# EAGLE design ENCODER_BUFFER (EAGLE 9.6.2)
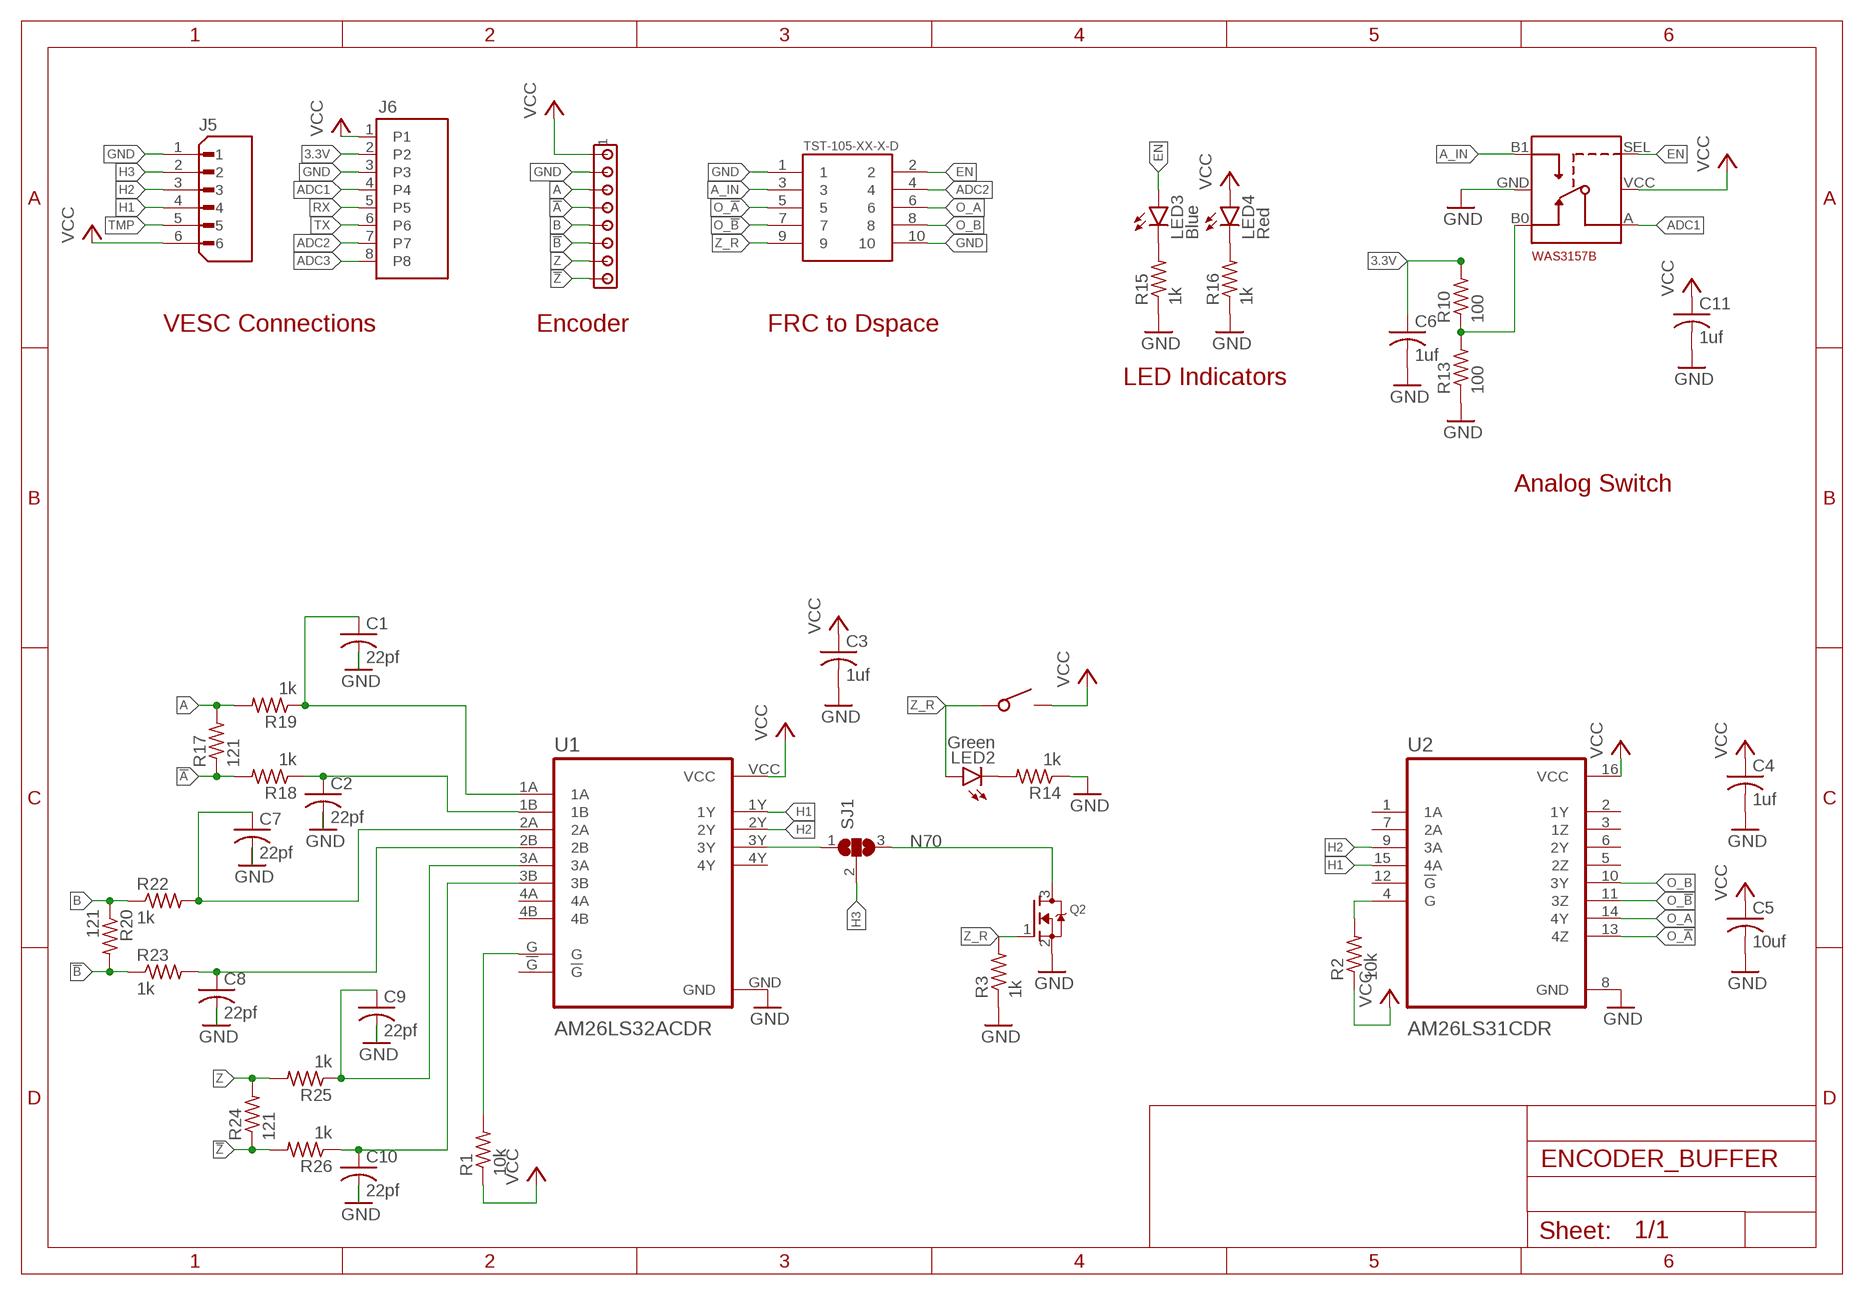
[diagram p0: schematic, sheet 1]

## Parts
C1  22pf  C-USC0402  [C0402]
C2  22pf  C-USC0402  [C0402]
C3  1uf  C-USC0402  [C0402]
C4  1uf  C-USC0402  [C0402]
C5  10uf  C-USC0402  [C0402]
C6  1uf  C-USC0402  [C0402]
C7  22pf  C-USC0402  [C0402]
C8  22pf  C-USC0402  [C0402]
C9  22pf  C-USC0402  [C0402]
C10  22pf  C-USC0402  [C0402]
C11  1uf  C-USC0402  [C0402]
J2  TST-105-XX-X-D  [TST-105-XX-X-D]
J3  MTA08-100  [10X08MTA]
J5  B6B-PH-K-S(LF)(SN)  [JST_B6B-PH-K-S(LF)(SN)]
J6  B8B-PH-K-S(LF)(SN)  [JST_B8B-PH-K-S(LF)(SN)]
LED2  Green  LEDCHIPLED_0603  [CHIPLED_0603]
LED3  Blue  LEDCHIPLED_0603  [CHIPLED_0603]
LED4  Red  LEDCHIPLED_0603  [CHIPLED_0603]
Q2  MOSFET-NREFLOW  [SOT23]
R1  10k  R-US_R0402  [R0402]
R2  10k  R-US_R0402  [R0402]
R3  1k  R-US_R0402  [R0402]
R10  100  R-US_R0402  [R0402]
R13  100  R-US_R0402  [R0402]
R14  1k  R-US_R0402  [R0402]
R15  1k  R-US_R0402  [R0402]
R16  1k  R-US_R0402  [R0402]
R17  121  R-US_R0402  [R0402]
R18  1k  R-US_R0402  [R0402]
R19  1k  R-US_R0402  [R0402]
R20  121  R-US_R0402  [R0402]
R22  1k  R-US_R0402  [R0402]
R23  1k  R-US_R0402  [R0402]
R24  121  R-US_R0402  [R0402]
R25  1k  R-US_R0402  [R0402]
R26  1k  R-US_R0402  [R0402]
SJ1  SJ2W  [SJ_2]
U1  AM26LS32ACDR  [SOIC127P600X175-16N]
U2  AM26LS31CDR  [SOIC127P600X175-16N]
U3  WAS3157BUMT6  [UMT6]
U$1  TS-1088-AR02016  [SMD]

## Nets
3.3V: C6.1 J6.2 R10.2
3Y: SJ1.1 U1.3Y
!A: J3.4 R17.1 R18.2
!B: J3.6 R20.2 R23.1
!Z: J3.8 R24.1 R26.2
A: J3.3 R17.2 R19.2
A_IN: J2.3 U3.B1
ADC1: J6.4 U3.A
ADC2: J2.4 J6.7
ADC3: J6.8
B: J3.5 R20.1 R22.1
EN: J2.2 LED3.A U3.SEL
GND: C1.2 C2.2 C3.2 C4.2 C5.2 C6.2 C7.2 C8.2 C9.2 C10.2 C11.2 J2.1 J2.10 J3.2 J5.1 J6.3 Q2.2(S) R3.1 R13.1 R14.1 R15.1 R16.1 U1.GND U2.8(GND) U3.GND
H1: J5.4 U1.1Y U2.15(4A)
H2: J5.3 U1.2Y U2.9(3A)
H3: J5.2 SJ1.2
N70: Q2.3(D) SJ1.3
N$1: C1.1 R19.1 U1.1A
N$2: C2.1 R18.1 U1.1B
N$3: R1.2 U1.G
N$4: R10.1 R13.2 U3.B0
N$5: C8.1 R23.2 U1.2B
N$6: C7.1 R22.2 U1.2A
N$7: LED2.C R14.2
N$8: LED3.C R15.2
N$9: LED4.C R16.2
N$10: R2.2 U2.4(G)
N$11: C9.1 R25.1 U1.3A
N$12: C10.1 R26.1 U1.3B
O_!A: J2.5 U2.13(4Z)
O_!B: J2.7 U2.11(3Z)
O_A: J2.6 U2.14(4Y)
O_B: J2.8 U2.10(3Y)
RX: J6.5
TMP: J5.5
TX: J6.6
VCC: C3.1 C4.1 C5.1 C11.1 J3.1 J5.6 J6.1 LED4.A R1.1 R2.1 U1.VCC U2.16(VCC) U3.VCC U$1.P$2
Z: J3.7 R24.2 R25.2
Z_R: J2.9 LED2.A Q2.1(G) R3.2 U$1.P$1
Unconnected: U1.4A U1.4B U1.4Y U1.!G U2.1(1A) U2.2(1Y) U2.3(1Z) U2.5(2Z) U2.6(2Y) U2.7(2A) U2.12(!G)

## Notes on the sheet
- WAS3157B
- VESC Connections | Encoder | FRC to Dspace
- LED Indicators
- Analog Switch

## Library data of the parts
C1-C11 = rcl:C-US: CAPACITOR, American symbol; SPICEPREFIX: C
J2 = TST-105-XX-X-D:TST-105-XX-X-D: 0.100" TOP SHROUD TERMINAL STRIP. MANUFACTURER: SAMTEC. Check availability <https://pricing.snapeda.com/parts/TST-105-03-S-D/Samtec/view-part?ref=eda>; AVAILABILITY: In Stock; CHECK_PRICES: https://www.snapeda.com/parts/TST-105-03-S-D/Samtec+Inc./view-part/?ref=eda; DESCRIPTION: Connector Header Through Hole 10 position 0.100 (2.54mm); MF: Samtec; MP: TST-105-03-S-D; PACKAGE: None; PRICE: None; PURCHASE-URL: https://pricing.snapeda.com/search?q=TST-105-03-S-D&ref=eda; SNAPEDA_LINK: https://www.snapeda.com/parts/TST-105-03-S-D/Samtec+Inc./view-part/?ref=snap
J3 = con-amp:MTA08-100: AMP connector
J5 = B6B-PH-K-S_LF__SN_:B6B-PH-K-S(LF)(SN): Check availability <https://pricing.snapeda.com/parts/B6B-PH-K-S%28LF%29%28SN%29/JST%20Sales/view-part?ref=eda>; AVAILABILITY: In Stock; CHECK_PRICES: https://www.snapeda.com/parts/B6B-PH-K-S(LF)(SN)/JST+Sales+America+Inc./view-part/?ref=eda; DESCRIPTION: Connector Header Through Hole 6 position 0.079 (2.00mm); MF: JST Sales; MP: B6B-PH-K-S(LF)(SN); PACKAGE: None; PRICE: None; SNAPEDA_LINK: https://www.snapeda.com/parts/B6B-PH-K-S(LF)(SN)/JST+Sales+America+Inc./view-part/?ref=snap
J6 = B8B-PH-K-S_LF__SN_:B8B-PH-K-S(LF)(SN): PH Series 2 mm Pitch 8 Position Through Hole Top Entry Shrouded Header Check availability <https://pricing.snapeda.com/parts/B8B-PH-K-S%28LF%29%28SN%29/JST%20Sales/view-part?ref=eda>; AVAILABILITY: In Stock; CHECK_PRICES: https://www.snapeda.com/parts/B8B-PH-K-S(LF)(SN)/JST+Sales+America+Inc./view-part/?ref=eda; DESCRIPTION: Connector Header Through Hole 8 position 0.079 (2.00mm); MF: JST Sales; MP: B8B-PH-K-S(LF)(SN); PACKAGE: None; PRICE: None; SNAPEDA_LINK: https://www.snapeda.com/parts/B8B-PH-K-S(LF)(SN)/JST+Sales+America+Inc./view-part/?ref=snap
LED2-LED4 = led:LED: LED OSRAM: - CHIPLED LG R971, LG N971, LY N971, LG Q971, LY Q971, LO R971, LY R971 LH N974, LH R974 LS Q976, LO Q976, LY Q976 LO Q996 - Hyper CHIPLED LW Q18S LB Q993, LB Q99A, LB R99A - SideLED LS A670, LO A670, LY A670, LG A670, LP A670 LB A673, LV A673, LT A673, LW A673 LH A674 LY A675 LS A676, LA A676, LO A676, LY A676, LW A676 LS A679, LY A679, LG A679 - Hyper Micro SIDELED® LS Y876, LA Y876, LO Y876, LY Y876 LT Y87S - SmartLED LW L88C, LW L88S LB L89C, LB L89S, LG L890 LS L89K, LO L89K, LY L89K LS L896, LA L896, LO L896, LY L896 - TOPLED LS T670, LO T670, LY T670, LG T670, LP T670 LSG T670, LSP T670, LSY T670, LOP T670, LYG T670 LG T671, LOG T671, LSG T671 LB T673, LV T673, LT T673, LW T673 LH T674 LS T676, LA T676, LO T676, LY T676, LB T676, LH T676, LSB T676, LW T676 LB T67C, LV T67C, LT T67C, LS T67K, LO T67K, LY T67K, LW E67C LS E67B, LA E67B, LO E67B, LY E67B, LB E67C, LV E67C, LT E67C LW T67C LS T679, LY T679, LG T679 LS T770, LO T770, LY T770, LG T770, LP T770 LB T773, LV T773, LT T773, LW T773 LH T774 LS E675, LA E675, LY E675, LS T675 LS T776, LA T776, LO T776, LY T776, LB T776 LHGB T686 LT T68C, LB T68C - Hyper Mini TOPLED® LB M676 - Mini TOPLED Santana® LG M470 LS M47K, LO M47K, LY M47K Source: http://www.osram.convergy.de LUXEON: - LUMILED® LXK2-PW12-R00, LXK2-PW12-S00, LXK2-PW14-U00, LXK2-PW14-V00 LXK2-PM12-R00, LXK2-PM12-S00, LXK2-PM14-U00 LXK2-PE12-Q00, LXK2-PE12-R00, LXK2-PE12-S00, LXK2-PE14-T00, LXK2-PE14-U00 LXK2-PB12-K00, LXK2-PB12-L00, LXK2-PB12-M00, LXK2-PB14-N00, LXK2-PB14-P00, LXK2-PB14-Q00 LXK2-PR12-L00, LXK2-PR12-M00, LXK2-PR14-Q00, LXK2-PR14-R00 LXK2-PD12-Q00, LXK2-PD12-R00, LXK2-PD12-S00 LXK2-PH12-R00, LXK2-PH12-S00 LXK2-PL12-P00, LXK2-PL12-Q00, LXK2-PL12-R00 Source: www.luxeon.com KINGBRIGHT: KA-3528ASYC Source: www.kingbright.com
Q2 = adafruit:MOSFET-N: N-Channel Mosfet 2N7002E - 60V 260mA SOT23 [Digikey: 2N7002ET1GOSTR-ND] - REEL BSH103 - 30V 850mA SOT23 [Digikey: 568-5013-1-ND]
R1-R3 R10 R13-R20 R22-R26 = rcl:R-US_: RESISTOR, American symbol; SPICEPREFIX: R
SJ1 = jumper:SJ2W: SMD solder JUMPER
U1 = AM26LS32ACDR:AM26LS32ACDR: Check availability <https://pricing.snapeda.com/parts/AM26LS31CDR/Texas%20Instruments/view-part?ref=eda>; AVAILABILITY: In Stock; DESCRIPTION: Quadruple differential line driver; MF: Texas Instruments; MP: AM26LS31CDR; PACKAGE: SOIC-16 Texas Instruments; PRICE: None; PURCHASE-URL: https://pricing.snapeda.com/search?q=AM26LS31CDR&ref=eda
U2 = AM26LS31CDR:AM26LS31CDR: Check availability <https://pricing.snapeda.com/parts/AM26LS31CDR/Texas%20Instruments/view-part?ref=eda>; AVAILABILITY: In Stock; DESCRIPTION: Quadruple differential line driver; MF: Texas Instruments; MP: AM26LS31CDR; PACKAGE: SOIC-16 Texas Instruments; PRICE: None; PURCHASE-URL: https://pricing.snapeda.com/search?q=AM26LS31CDR&ref=eda
U3 = WAS3157B:WAS3157B: UMT6 Check availability <https://pricing.snapeda.com/parts/UMH3N/Rohm/view-part?ref=eda>; AVAILABILITY: In Stock; CHECK_PRICES: https://www.snapeda.com/parts/UMH3N/Rohm/view-part/?ref=eda; DESCRIPTION: Pre-Biased Bipolar Transistor (BJT) 2 NPN - Pre-Biased (Dual) 50V 100mA 250MHz 150mW Surface Mount UMT6; MF: Rohm; MP: UMH3N; PACKAGE: SOT-363 Rohm; PRICE: None; SNAPEDA_LINK: https://www.snapeda.com/parts/UMH3N/Rohm/view-part/?ref=snap
U$1 = TS-1088-AR02016:TS-1088-AR02016

## Board
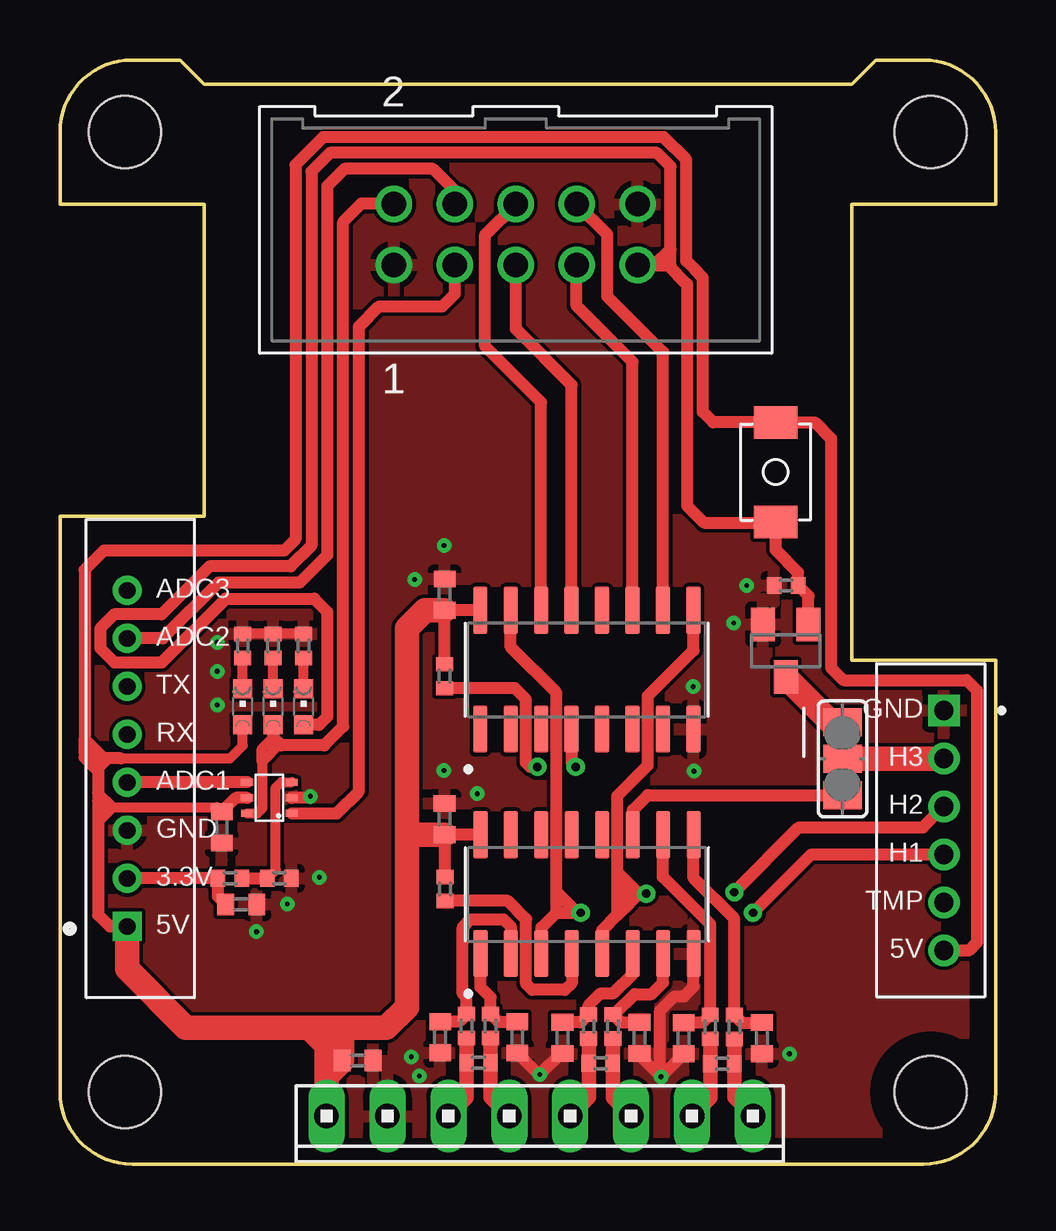
[diagram p1: board, top side]
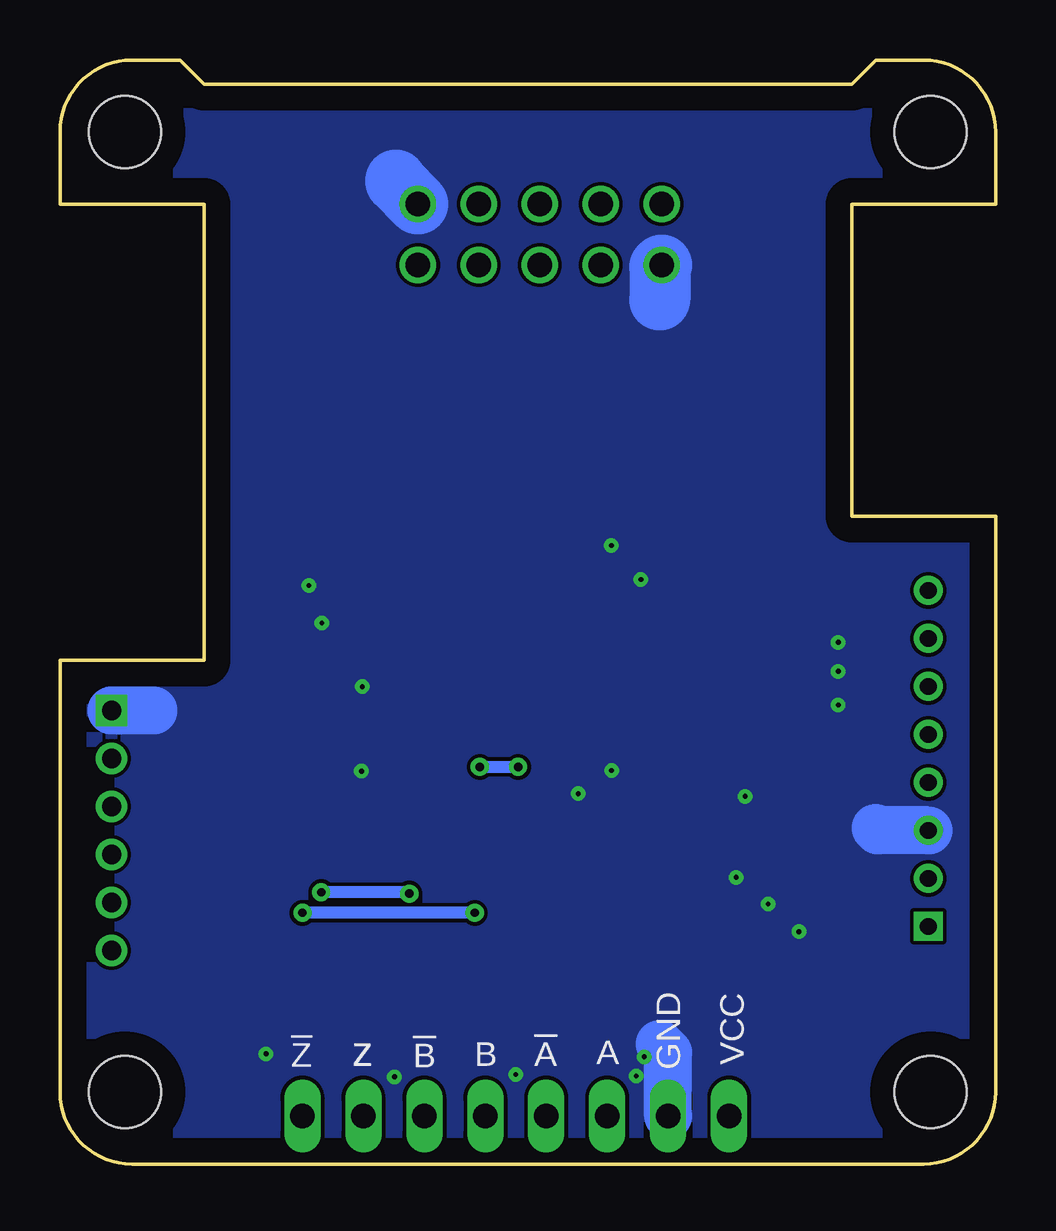
[diagram p2: board, bottom side, seen from below]

Size 39 x 46 mm. Coordinates in mm from the lower left corner, seen from the top.
Outline: 39,21 39,3 arc-90 36,0 3,0 arc-90 0,3 0,27 6,27 6,40 0,40 0,43 arc-90 3,46 5,46 6,45 33,45 34,46 36,46 arc-90 39,43 39,40 33,40 33,21 39,21
Copper layers (1*16): Top 0.035mm / dielectric 1.5mm / Bottom 0.035mm
Design rules "default *": minimum track width 6mil, minimum drill 0.35mm, track to track 6mil, track to pad 6mil, pad to pad 6mil, via to via 6mil, smd to smd 6mil, copper to edge 40mil, drill to drill 6mil, minimum pad ring 10mil, minimum via ring 8mil, stop-mask expansion 4mil, vias tented up to drill 100mil, thermal gap 10mil
Holes 3 mm at 2.7,43 36.3,43 36.3,3 2.7,3

### Footprints (pad centres in the part's own frame; a part is rotated, then mirrored left to right if it is on the bottom)
C0402 = smd 0.7 x 0.9: 1 -0.65,0; 2 0.65,0
TST-105-XX-X-D = drill 1.016 pad 1.524: 1 -5.08,-1.27; 2 -5.08,1.27; 3 -2.54,-1.27; 4 -2.54,1.27; 5 0,-1.27; 6 0,1.27; 7 2.54,-1.27; 8 2.54,1.27; 9 5.08,-1.27; 10 5.08,1.27
10X08MTA = drill 1.016 long: 1 8.89,0; 2 6.35,0; 3 3.81,0; 4 1.27,0; 5 -1.27,0; 6 -3.81,0; 7 -6.35,0; 8 -8.89,0
JST_B6B-PH-K-S(LF)(SN) = drill 0.8 square: 1 5,-0.55 | drill 0.8: 2 3,-0.55; 3 1,-0.55; 4 -1,-0.55; 5 -3,-0.55; 6 -5,-0.55
JST_B8B-PH-K-S(LF)(SN) = drill 0.7 square: 1 0,0 | drill 0.7: 2 2,0; 3 4,0; 4 6,0; 5 8,0; 6 10,0; 7 12,0; 8 14,0
CHIPLED_0603 = smd 0.8 x 0.8: A 0,-0.75; C 0,0.75
SOT23 = smd 1 x 1.4: 1 -0.95,-1.1; 2 0.95,-1.1; 3 0,1.1
R0402 = smd 0.6 x 0.7: 1 -0.5,0; 2 0.5,0
SJ_2 = smd 1.168 x 1.6: 1 -1.524,0; 2 0,0; 3 1.524,0
SOIC127P600X175-16N = smd 1.97 x 0.6: 1A -2.475,3.175; 1B -2.475,4.445; 1Y -2.475,1.905; 2A -2.475,-1.905; 2B -2.475,-3.175; 2Y -2.475,-0.635; 3A 2.475,-3.175; 3B 2.475,-4.445; 3Y 2.475,-1.905; 4A 2.475,1.905; 4B 2.475,3.175; 4Y 2.475,0.635; !G 2.475,-0.635; G -2.475,0.635; GND -2.475,-4.445; VCC 2.475,4.445
SOIC127P600X175-16N' = smd 1.97 x 0.6: 1 -2.475,4.445; 2 -2.475,3.175; 3 -2.475,1.905; 4 -2.475,0.635; 5 -2.475,-0.635; 6 -2.475,-1.905; 7 -2.475,-3.175; 8 -2.475,-4.445; 9 2.475,-4.445; 10 2.475,-3.175; 11 2.475,-1.905; 12 2.475,-0.635; 13 2.475,0.635; 14 2.475,1.905; 15 2.475,3.175; 16 2.475,4.445
UMT6 = smd 0.5 x 0.3: A 0.925,-0.65; B0 -0.925,-0.65; B1 -0.925,0.65; GND -0.925,0; SEL 0.925,0.65; VCC 0.925,0
SMD = smd 1.35 x 1.8: P$1 -2.075,0; P$2 2.075,0

### Placement (x,y rotation side)
C1  15.85,5.28 270 top
C2  19.06,5.28 270 top
C3  16.03,14.37 90 top
C4  16.04,23.73 90 top
C5  12.41,4.31 0 top
C6  7.56,10.82 0 top
C7  20.95,5.25 270 top
C8  24.16,5.25 270 top
C9  25.99,5.24 270 top
C10  29.26,5.24 270 top
C11  6.75,14.02 270 top
J2  19,38.73 0 top
J3  20,2 180 top
J5  36.3,13.9 90 top
J6  2.8,9.9 90 top
LED2  10.16,19.05 0 top
LED3  8.89,19.05 0 top
LED4  7.62,19.05 0 top
Q2  30.25,21.39 180 top
R1  16.05,11.46 270 top
R2  16.03,20.32 270 top
R3  30.27,24.11 0 top
R10  7.09,11.91 180 top
R13  9.15,11.9 180 top
R14  10.16,21.59 270 top
R15  8.89,21.59 270 top
R16  7.62,21.59 270 top
R17  17.45,4.22 180 top
R18  17.95,5.75 270 top
R19  16.95,5.75 270 top
R20  22.54,4.19 0 top
R22  22.04,5.73 90 top
R23  23.05,5.73 90 top
R24  27.61,4.18 180 top
R25  27.11,5.72 270 top
R26  28.11,5.72 270 top
SJ1  32.62,16.88 90 top
U1  21.97,11.24 90 top
U2  AM26LS31CDR  [SOIC127P600X175-16N']  21.96,20.59 90 top
U3  8.73,15.26 180 top
U$1  29.84,28.83 90 top

### Tracks (layer width: path | path; a pad name or v marks a point on that pad's centre or on a via)
3.3V
  Top 0.508: C6.1 6.59,11.14 R10.2 J6.2
3Y
  Top 0.508: U1.3Y 23.88,14.75 24.5,15.37 32.6,15.37 SJ1.1
!A
  Top 0.61: J3.4 17.95,2.78 R17.1 R18.2
!B
  Top 0.61: J3.6 23.05,2.77 R20.2 R23.1
!Z
  Top 0.61: J3.8 28.11,2.78 R24.1 R26.2
A
  Top 0.61: J3.3 16.95,2.76 R17.2 R19.2
A_IN
  Top 0.508: U3.B1 11.54,14.61 12.46,15.54 12.46,34.89 13.31,35.74 15.94,35.74 16.46,36.25 J2.3
ADC1
  Top 0.508: U3.A J6.4
ADC2
  Top 0.508: J2.4 16.46,40.55 15.55,41.46 11.86,41.46 11.14,40.74 11.14,25.38 9.99,24.23 6.62,24.23 4.29,21.9 J6.7
B
  Top 0.61: J3.5 22.05,2.77 R20.1 R22.1
EN
  Top 0.406: U3.SEL 8.22,14.61 8.44,14.82 8.44,16.76 | 8.54,17.44 8.89,17.79 | 9.12,17.44 8.54,17.44 | 8.54,17.44 8.41,17.31 8.41,16.74 8.44,16.76 | 9.24,17.44 9.12,17.44 | 9.12,17.44 8.44,16.76
  Top 0.508: LED3.A 8.89,17.79 9.24,17.44 11.01,17.44 11.8,18.23 11.8,39.26 12.57,40.02 13.9,40.02 J2.2
GND  (via drill 0.2 pad 0.3)
  Top 0.406: R14.1 R15.1 R16.1
  Top 0.508: U3.GND 10.39,15.27 v10.44,15.32 | C2.2 19.95,3.73 v20,3.73 20.86,4.6 C7.2 | v25.05,3.63 24.16,4.53 C8.2 | v25.05,3.63 25.99,4.57 C9.2 | v25.05,3.63 25.02,3.67 25.02,6.39 25.62,6.99 26.01,6.99 26.41,7.39 U1.GND
  Bottom 1.016: 35.1,18.9 35,19
  Bottom 2: J6.3 4.9,13.9 5,14 | J5.1 35.1,18.9 | J3.2 13.65,4.65 14,5
  Bottom 2.54: J2.1 14,37.38 14,36 | J2.10 25,40.92 25,41
  other vias: 9.48,10.83 8.2,9.68 10.81,11.94 6.56,21.74 6.56,20.53 6.56,19.12 14.98,3.66 26.39,19.89 26.43,16.37 28.63,24.1 28.09,22.54 14.78,24.36 17.4,15.43 16.01,16.4 16.01,25.77 14.65,4.46 30.41,4.59
  pour Bottom: -9,47 -9,-4 45,-4 45,51 -9,51
  pour Top: -1,47 -1,-1 40,-1 40,47
H1  (via drill 0.35)
  Top 0.508: U1.1Y 20.07,9.85 20.69,10.47 | U2.15 18.79,21.54 20.7,19.63 20.7,11.34 | 20.7,10.48 | 20.7,10.48 20.7,11.34 | 20.69,10.47 20.7,10.48 | v21.71,10.47 21.7,10.48 20.7,10.48 | v21.71,10.47 21.57,10.47 20.7,11.34 | 20.69,10.47 v21.71,10.47 | v28.89,10.47 31.32,12.9 J5.4
  Bottom 0.508: v21.71,10.47 v28.89,10.47
H2  (via drill 0.35)
  Top 0.508: U1.2Y 22.61,9.74 23.24,10.38 | 23.24,10.38 23.24,11.27 | 23.24,11.48 23.24,12.04 | 23.24,12.04 23.24,15.34 24.51,16.61 24.51,19.51 26.41,21.41 U2.9 | 24.13,11.27 v24.43,11.27 v24.44,11.27 | 23.75,10.89 23.24,10.38 | 23.75,10.89 24.13,11.27 | 23.58,11.82 23.36,12.04 23.24,12.04 | 23.58,11.82 24.13,11.27 | 23.24,11.27 23.24,11.48 | 23.24,11.48 23.58,11.82 | 24.13,11.27 23.37,11.27 | 23.24,11.27 23.37,11.27 | 23.37,11.27 23.75,10.89 | v28.11,11.32 30.81,14.02 35.97,14.02 J5.3
  Bottom 0.508: v24.44,11.27 24.5,11.32 v28.11,11.32
H3
  Top 1.016: SJ1.2 36.83,16.88 J5.2
N70
  Top 1.016: SJ1.3 32.14,18.4 Q2.3
N$1
  Top 0.508: U1.1A 18.8,9.89 18.5,10.19 17.12,10.19 16.79,9.85 16.79,7.1 16.95,6.94 R19.1 16.62,5.93 C1.1
N$2
  Top 0.508: U1.1B 17.52,7.37 17.95,6.95 R18.1 18.27,5.93 C2.1
N$3
  Top 0.508: U1.G 21.34,7.54 21.05,7.25 19.68,7.25 19.43,7.5 19.43,10.2 18.67,10.96 R1.2
N$4
  Top 0.406: R13.2 9,12.25 9,15.68 9.23,15.91 U3.B0
  Top 0.508: R10.1 R13.2
N$5
  Top 0.508: U1.2B 25.14,7.56 24.66,7.08 23.97,7.08 23.11,6.23 R23.2 23.37,5.9 C8.1
N$6
  Top 0.508: U1.2A 23.88,7.93 23.05,7.11 22.54,7.11 22.04,6.61 R22.2 21.71,5.9 C7.1
N$7
  Top 0.406: LED2.C R14.2
N$8
  Top 0.406: LED3.C R15.2
N$9
  Top 0.406: LED4.C R16.2
N$10  (via drill 0.35)
  Top 0.508: U2.4 21.33,16.71 v21.5,16.55 | v19.9,16.55 19.59,16.55 19.42,16.72 19.42,19.36 18.96,19.82 R2.2
  Bottom 0.508: v21.5,16.55 v19.9,16.55
N$11
  Top 0.508: C9.1 26.78,5.89 R25.1 27.11,9.99 25.13,11.97 U1.3A
N$12
  Top 0.508: C10.1 28.43,5.89 R26.1 28.11,10.21 26.41,11.91 U1.3B
O_!A
  Top 0.508: U2.13 21.33,32.47 19,34.8 J2.5
O_!B
  Top 0.508: U2.11 23.87,33.42 21.54,35.75 J2.7
O_A
  Top 0.508: U2.14 20.06,31.74 17.73,34.07 17.73,38.73 J2.6
O_B
  Top 0.508: U2.10 25.14,33.82 22.82,36.14 22.82,38.72 J2.8
VCC
  Top 0.406: 1.59,14.25 2.21,14.87 | 2.21,14.87 6.55,14.87 C11.1 | 1.59,10.38 1.59,14.25 | 1.59,14.25 1.59,14.86 | 1.59,14.86 1.59,15.13 1.59,15.48 | 1.59,15.48 1.59,16.36 1.59,16.51 1.99,16.9 2.54,16.9 7.09,16.9 7.62,17.43 LED4.A | 2.21,14.87 1.61,14.87 1.59,14.86 | 2.21,14.87 1.6,15.48 1.59,15.48
  Top 0.508: U3.VCC 7.33,15.26 C11.1 | 26.48,37.25 26.8,36.94 26.8,31.34 27.24,30.9 U$1.P$2 31.46,30.9 32.14,30.22 32.14,20.68 32.66,20.16 37.8,20.16 38.23,19.73 38.23,9.24 37.88,8.89 J5.6 | 26.48,37.25 | 26.48,37.25 26.11,37.63 26.11,41.84 25.16,42.79 10.98,42.79 9.82,41.63 9.82,26.04 9.34,25.56 1.83,25.56 1.02,24.75 1.02,17.69 | 1.06,16.9 1.36,16.6 | 1.36,16.6 1.59,16.36 | 1.02,17.26 1.02,17.15 | 1.02,17.15 1.02,16.94 1.06,16.9 | 1.59,16.51 1.59,15.13 | 1.36,16.6 1.68,16.6 | 1.68,16.6 1.99,16.9 1.81,16.9 1.02,17.69 | 1.6,15.48 1.59,15.47 1.59,10.38 2.07,9.9 J6.1 | 2.54,16.9 1.27,16.9 | 1.27,16.9 1.06,16.9 | 1.27,16.9 1.02,17.15 | 1.68,16.6 1.02,17.26 | 1.02,17.26 1.02,17.69 | U2.16 16.04,23.07 C4.1 R2.1 | U1.VCC 16.04,13.71 | 16.04,13.71 C3.1 | R1.1 16.05,13.7 16.04,13.71
  Top 1.016: C4.1 15.21,23.08 14.46,22.33 14.46,13.97 | 11.43,5.68 13.6,5.68 14.46,6.54 14.46,13.97 | 11.43,5.68 10.38,5.68 | 10.38,5.68 5.24,5.68 2.8,8.12 J6.1 | C5.1 11.11,3.66 J3.1 11.11,5.36 11.43,5.68 | C5.1 11.76,5.36 11.43,5.68 | C5.1 10.38,5.68 | C3.1 14.71,13.72 14.46,13.97
Z
  Top 0.61: J3.7 27.11,2.76 R24.2 R25.2 | R25.2
Z_R
  Top 0.508: Q2.1 31.2,23.67 R3.2 30.77,24.65 29.84,25.58 U$1.P$1 29.81,26.73 26.85,26.73 26.14,27.43 26.14,36.66 25.34,37.46 24.81,37.46 | J2.9 24.1,37.44 25.45,37.44 25.45,38.1 | 25.45,38.1 25.45,41.56 24.89,42.13 11.25,42.13 10.48,41.36 10.48,25.76 9.62,24.9 6.23,24.9 4.23,22.9 2.26,22.9 1.68,22.32 1.68,21.49 2.26,20.9 4.24,20.9 6.9,23.55 10.6,23.55 11.14,23.01 11.14,18.64 10.8,18.3 LED2.A | 25.45,38.1 24.81,37.46 | 24.81,37.46 J2.9 | J2.9 24.81,37.46

### Text on the board
tPlace: ADC3 | ADC2 | TX | GND | RX | H3 | ADC1 | H2 | GND | H1 | 3.3V | TMP | 5V | 5V
bPlace: VCC | GND | A | !A | B | !B | z | !Z